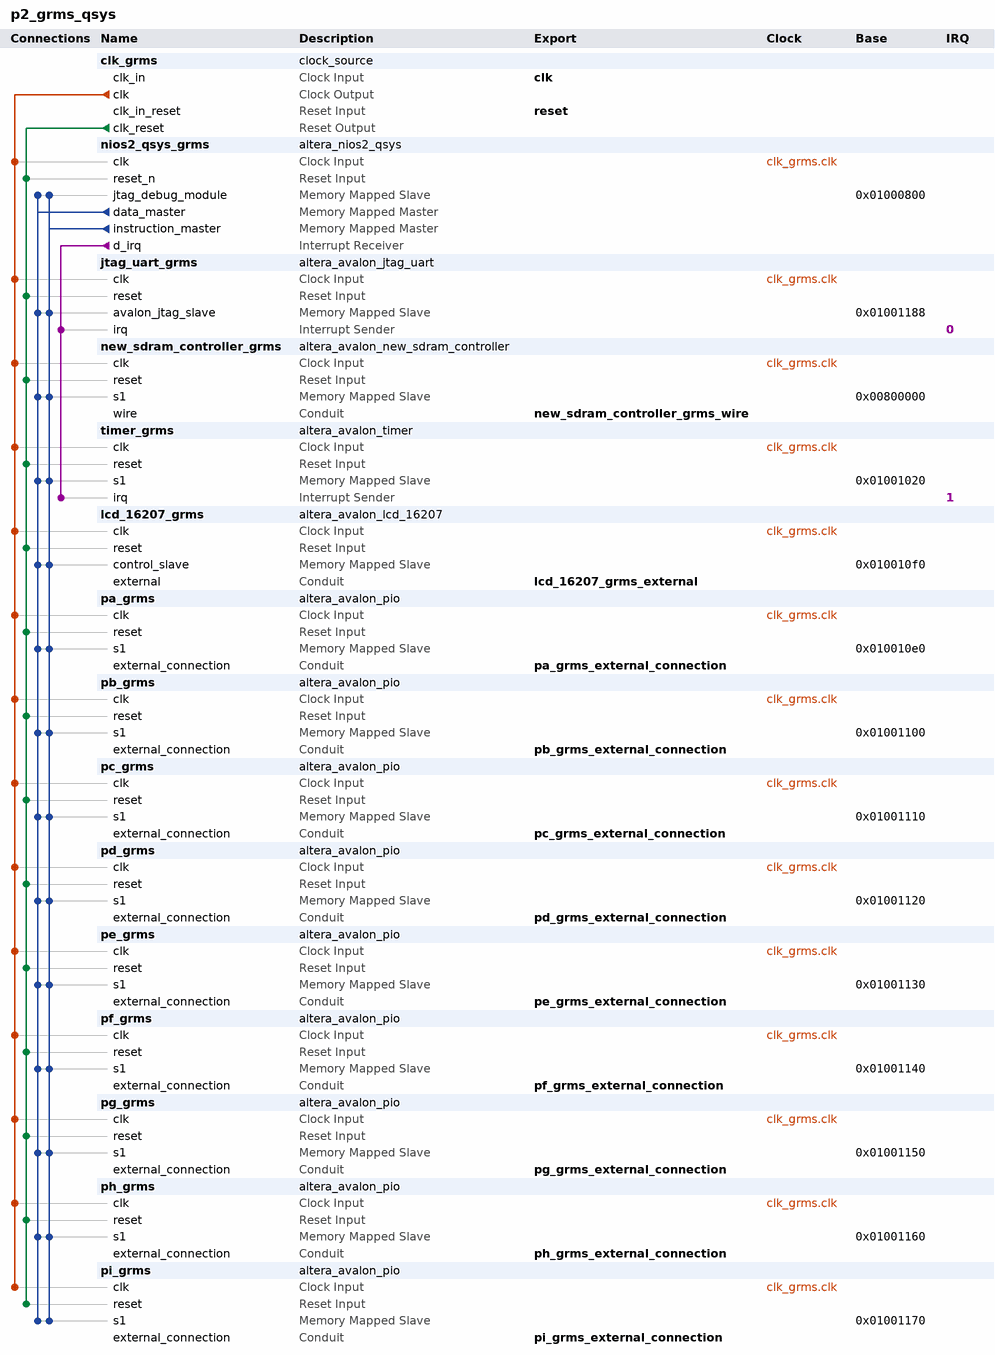
[diagram p0: system contents]
# Platform Designer (Qsys) system p2_grms_qsys, Cyclone II EP2C35F672C6
# Parameters at their usual value, and those the tool derives, are not listed.
package require -exact qsys 13.0.1.99.2
create_system p2_grms_qsys
set_project_property DEVICE_FAMILY {Cyclone II}
set_project_property DEVICE EP2C35F672C6

add_instance clk_grms clock_source 13.0
set_instance_parameter_value clk_grms clockFrequency 50000000

add_instance nios2_qsys_grms altera_nios2_qsys 13.0
set_instance_parameter_value nios2_qsys_grms resetSlave new_sdram_controller_grms.s1
set_instance_parameter_value nios2_qsys_grms mmu_TLBMissExcSlave None
set_instance_parameter_value nios2_qsys_grms exceptionSlave new_sdram_controller_grms.s1
set_instance_parameter_value nios2_qsys_grms breakSlave nios2_qsys_grms.jtag_debug_module
set_instance_parameter_value nios2_qsys_grms impl Tiny
set_instance_parameter_value nios2_qsys_grms icache_size 4096

add_instance jtag_uart_grms altera_avalon_jtag_uart 13.0.1.99.2
set_instance_parameter_value jtag_uart_grms simInteractiveOptions NO_INTERACTIVE_WINDOWS

add_instance new_sdram_controller_grms altera_avalon_new_sdram_controller 13.0.1.99.2
set_instance_parameter_value new_sdram_controller_grms TAC 5.5
set_instance_parameter_value new_sdram_controller_grms TRCD 20.0
set_instance_parameter_value new_sdram_controller_grms TRP 20.0
set_instance_parameter_value new_sdram_controller_grms casLatency 3
set_instance_parameter_value new_sdram_controller_grms columnWidth 8
set_instance_parameter_value new_sdram_controller_grms dataWidth 16
set_instance_parameter_value new_sdram_controller_grms generateSimulationModel false
set_instance_parameter_value new_sdram_controller_grms model single_Micron_MT48LC4M32B2_7_chip
set_instance_parameter_value new_sdram_controller_grms numberOfBanks 4
set_instance_parameter_value new_sdram_controller_grms numberOfChipSelects 1
set_instance_parameter_value new_sdram_controller_grms powerUpDelay 100.0
set_instance_parameter_value new_sdram_controller_grms refreshPeriod 15.625
set_instance_parameter_value new_sdram_controller_grms rowWidth 12

add_instance timer_grms altera_avalon_timer 13.0.1.99.2
set_instance_parameter_value timer_grms period 1
set_instance_parameter_value timer_grms periodUnits MSEC

add_instance lcd_16207_grms altera_avalon_lcd_16207 13.0.1.99.2

add_instance pa_grms altera_avalon_pio 13.0.1.99.2
set_instance_parameter_value pa_grms direction Input
set_instance_parameter_value pa_grms width 8

add_instance pb_grms altera_avalon_pio 13.0.1.99.2
set_instance_parameter_value pb_grms direction Input
set_instance_parameter_value pb_grms width 4

add_instance pc_grms altera_avalon_pio 13.0.1.99.2
set_instance_parameter_value pc_grms direction Output
set_instance_parameter_value pc_grms width 1

add_instance pd_grms altera_avalon_pio 13.0.1.99.2
set_instance_parameter_value pd_grms direction Output
set_instance_parameter_value pd_grms width 8

add_instance pe_grms altera_avalon_pio 13.0.1.99.2
set_instance_parameter_value pe_grms direction Output
set_instance_parameter_value pe_grms width 8

add_instance pf_grms altera_avalon_pio 13.0.1.99.2
set_instance_parameter_value pf_grms direction Output
set_instance_parameter_value pf_grms width 7

add_instance pg_grms altera_avalon_pio 13.0.1.99.2
set_instance_parameter_value pg_grms direction Output
set_instance_parameter_value pg_grms width 7

add_instance ph_grms altera_avalon_pio 13.0.1.99.2
set_instance_parameter_value ph_grms direction Output
set_instance_parameter_value ph_grms width 4

add_instance pi_grms altera_avalon_pio 13.0.1.99.2
set_instance_parameter_value pi_grms direction Output
set_instance_parameter_value pi_grms width 4

# connections
add_connection clk_grms.clk jtag_uart_grms.clk clock
add_connection clk_grms.clk lcd_16207_grms.clk clock
add_connection clk_grms.clk new_sdram_controller_grms.clk clock
add_connection clk_grms.clk nios2_qsys_grms.clk clock
add_connection clk_grms.clk pa_grms.clk clock
add_connection clk_grms.clk pb_grms.clk clock
add_connection clk_grms.clk pc_grms.clk clock
add_connection clk_grms.clk pd_grms.clk clock
add_connection clk_grms.clk pe_grms.clk clock
add_connection clk_grms.clk pf_grms.clk clock
add_connection clk_grms.clk pg_grms.clk clock
add_connection clk_grms.clk ph_grms.clk clock
add_connection clk_grms.clk pi_grms.clk clock
add_connection clk_grms.clk timer_grms.clk clock
add_connection clk_grms.clk_reset jtag_uart_grms.reset reset
add_connection clk_grms.clk_reset lcd_16207_grms.reset reset
add_connection clk_grms.clk_reset new_sdram_controller_grms.reset reset
add_connection clk_grms.clk_reset nios2_qsys_grms.reset_n reset
add_connection clk_grms.clk_reset pa_grms.reset reset
add_connection clk_grms.clk_reset pb_grms.reset reset
add_connection clk_grms.clk_reset pc_grms.reset reset
add_connection clk_grms.clk_reset pd_grms.reset reset
add_connection clk_grms.clk_reset pe_grms.reset reset
add_connection clk_grms.clk_reset pf_grms.reset reset
add_connection clk_grms.clk_reset pg_grms.reset reset
add_connection clk_grms.clk_reset ph_grms.reset reset
add_connection clk_grms.clk_reset pi_grms.reset reset
add_connection clk_grms.clk_reset timer_grms.reset reset
add_connection nios2_qsys_grms.data_master jtag_uart_grms.avalon_jtag_slave avalon
set_connection_parameter_value nios2_qsys_grms.data_master/jtag_uart_grms.avalon_jtag_slave baseAddress 0x01001188
add_connection nios2_qsys_grms.data_master lcd_16207_grms.control_slave avalon
set_connection_parameter_value nios2_qsys_grms.data_master/lcd_16207_grms.control_slave baseAddress 0x010010f0
add_connection nios2_qsys_grms.data_master new_sdram_controller_grms.s1 avalon
set_connection_parameter_value nios2_qsys_grms.data_master/new_sdram_controller_grms.s1 baseAddress 0x00800000
add_connection nios2_qsys_grms.data_master nios2_qsys_grms.jtag_debug_module avalon
set_connection_parameter_value nios2_qsys_grms.data_master/nios2_qsys_grms.jtag_debug_module baseAddress 0x01000800
add_connection nios2_qsys_grms.data_master pa_grms.s1 avalon
set_connection_parameter_value nios2_qsys_grms.data_master/pa_grms.s1 baseAddress 0x010010e0
add_connection nios2_qsys_grms.data_master pb_grms.s1 avalon
set_connection_parameter_value nios2_qsys_grms.data_master/pb_grms.s1 baseAddress 0x01001100
add_connection nios2_qsys_grms.data_master pc_grms.s1 avalon
set_connection_parameter_value nios2_qsys_grms.data_master/pc_grms.s1 baseAddress 0x01001110
add_connection nios2_qsys_grms.data_master pd_grms.s1 avalon
set_connection_parameter_value nios2_qsys_grms.data_master/pd_grms.s1 baseAddress 0x01001120
add_connection nios2_qsys_grms.data_master pe_grms.s1 avalon
set_connection_parameter_value nios2_qsys_grms.data_master/pe_grms.s1 baseAddress 0x01001130
add_connection nios2_qsys_grms.data_master pf_grms.s1 avalon
set_connection_parameter_value nios2_qsys_grms.data_master/pf_grms.s1 baseAddress 0x01001140
add_connection nios2_qsys_grms.data_master pg_grms.s1 avalon
set_connection_parameter_value nios2_qsys_grms.data_master/pg_grms.s1 baseAddress 0x01001150
add_connection nios2_qsys_grms.data_master ph_grms.s1 avalon
set_connection_parameter_value nios2_qsys_grms.data_master/ph_grms.s1 baseAddress 0x01001160
add_connection nios2_qsys_grms.data_master pi_grms.s1 avalon
set_connection_parameter_value nios2_qsys_grms.data_master/pi_grms.s1 baseAddress 0x01001170
add_connection nios2_qsys_grms.data_master timer_grms.s1 avalon
set_connection_parameter_value nios2_qsys_grms.data_master/timer_grms.s1 baseAddress 0x01001020
add_connection nios2_qsys_grms.instruction_master jtag_uart_grms.avalon_jtag_slave avalon
set_connection_parameter_value nios2_qsys_grms.instruction_master/jtag_uart_grms.avalon_jtag_slave baseAddress 0x01001188
add_connection nios2_qsys_grms.instruction_master lcd_16207_grms.control_slave avalon
set_connection_parameter_value nios2_qsys_grms.instruction_master/lcd_16207_grms.control_slave baseAddress 0x010010f0
add_connection nios2_qsys_grms.instruction_master new_sdram_controller_grms.s1 avalon
set_connection_parameter_value nios2_qsys_grms.instruction_master/new_sdram_controller_grms.s1 baseAddress 0x00800000
add_connection nios2_qsys_grms.instruction_master nios2_qsys_grms.jtag_debug_module avalon
set_connection_parameter_value nios2_qsys_grms.instruction_master/nios2_qsys_grms.jtag_debug_module baseAddress 0x01000800
add_connection nios2_qsys_grms.instruction_master pa_grms.s1 avalon
set_connection_parameter_value nios2_qsys_grms.instruction_master/pa_grms.s1 baseAddress 0x010010e0
add_connection nios2_qsys_grms.instruction_master pb_grms.s1 avalon
set_connection_parameter_value nios2_qsys_grms.instruction_master/pb_grms.s1 baseAddress 0x01001100
add_connection nios2_qsys_grms.instruction_master pc_grms.s1 avalon
set_connection_parameter_value nios2_qsys_grms.instruction_master/pc_grms.s1 baseAddress 0x01001110
add_connection nios2_qsys_grms.instruction_master pd_grms.s1 avalon
set_connection_parameter_value nios2_qsys_grms.instruction_master/pd_grms.s1 baseAddress 0x01001120
add_connection nios2_qsys_grms.instruction_master pe_grms.s1 avalon
set_connection_parameter_value nios2_qsys_grms.instruction_master/pe_grms.s1 baseAddress 0x01001130
add_connection nios2_qsys_grms.instruction_master pf_grms.s1 avalon
set_connection_parameter_value nios2_qsys_grms.instruction_master/pf_grms.s1 baseAddress 0x01001140
add_connection nios2_qsys_grms.instruction_master pg_grms.s1 avalon
set_connection_parameter_value nios2_qsys_grms.instruction_master/pg_grms.s1 baseAddress 0x01001150
add_connection nios2_qsys_grms.instruction_master ph_grms.s1 avalon
set_connection_parameter_value nios2_qsys_grms.instruction_master/ph_grms.s1 baseAddress 0x01001160
add_connection nios2_qsys_grms.instruction_master pi_grms.s1 avalon
set_connection_parameter_value nios2_qsys_grms.instruction_master/pi_grms.s1 baseAddress 0x01001170
add_connection nios2_qsys_grms.instruction_master timer_grms.s1 avalon
set_connection_parameter_value nios2_qsys_grms.instruction_master/timer_grms.s1 baseAddress 0x01001020
add_connection nios2_qsys_grms.d_irq jtag_uart_grms.irq interrupt
set_connection_parameter_value nios2_qsys_grms.d_irq/jtag_uart_grms.irq irqNumber 0
add_connection nios2_qsys_grms.d_irq timer_grms.irq interrupt
set_connection_parameter_value nios2_qsys_grms.d_irq/timer_grms.irq irqNumber 1

# exported interfaces
add_interface clk clock sink
set_interface_property clk EXPORT_OF clk_grms.clk_in
add_interface reset reset sink
set_interface_property reset EXPORT_OF clk_grms.clk_in_reset
add_interface pi_grms_external_connection conduit end
set_interface_property pi_grms_external_connection EXPORT_OF pi_grms.external_connection
add_interface ph_grms_external_connection conduit end
set_interface_property ph_grms_external_connection EXPORT_OF ph_grms.external_connection
add_interface pg_grms_external_connection conduit end
set_interface_property pg_grms_external_connection EXPORT_OF pg_grms.external_connection
add_interface pf_grms_external_connection conduit end
set_interface_property pf_grms_external_connection EXPORT_OF pf_grms.external_connection
add_interface pe_grms_external_connection conduit end
set_interface_property pe_grms_external_connection EXPORT_OF pe_grms.external_connection
add_interface pd_grms_external_connection conduit end
set_interface_property pd_grms_external_connection EXPORT_OF pd_grms.external_connection
add_interface pc_grms_external_connection conduit end
set_interface_property pc_grms_external_connection EXPORT_OF pc_grms.external_connection
add_interface pb_grms_external_connection conduit end
set_interface_property pb_grms_external_connection EXPORT_OF pb_grms.external_connection
add_interface pa_grms_external_connection conduit end
set_interface_property pa_grms_external_connection EXPORT_OF pa_grms.external_connection
add_interface lcd_16207_grms_external conduit end
set_interface_property lcd_16207_grms_external EXPORT_OF lcd_16207_grms.external
add_interface new_sdram_controller_grms_wire conduit end
set_interface_property new_sdram_controller_grms_wire EXPORT_OF new_sdram_controller_grms.wire

set_interconnect_requirement {$system} qsys_mm.clockCrossingAdapter HANDSHAKE
set_interconnect_requirement {$system} qsys_mm.maxAdditionalLatency 1

save_system p2_grms_qsys.qsys
